# Altium project PCB_Project.PrjPcb (part 11 of 11)
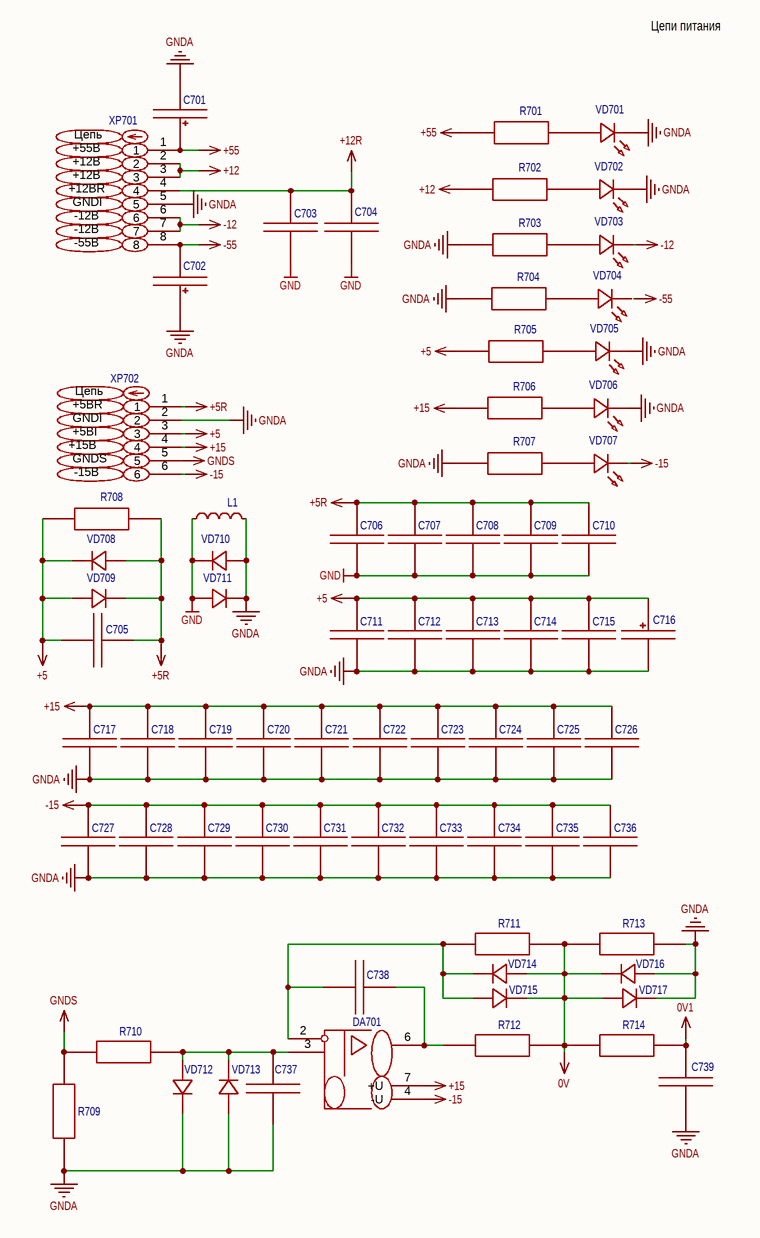
[diagram p14: УШЯИ.411618.029Э Э3 Лист 7.schdoc]

## Nets that join several sheets
0V: УШЯИ.411618.029Э Э3 Лист 2 (9 pins), УШЯИ.411618.029Э Э3 Лист 3 (R302.1 VD301.1 VD302.2), УШЯИ.411618.029Э Э3 Лист 5 (C517.2 R505.1 R519.1 R527.1), УШЯИ.411618.029Э Э3 Лист 6 (10 pins), УШЯИ.411618.029Э Э3 Лист 7 (8 pins)
0V1: УШЯИ.411618.029Э Э3 Лист 6 (DA605.2), УШЯИ.411618.029Э Э3 Лист 7 (C739.2 R714.1)
4.096V: УШЯИ.411618.029Э Э3 Лист 2 (6 pins), УШЯИ.411618.029Э Э3 Лист 6 (R625.1 R631.1)
+5: УШЯИ.411618.029Э Э3 Лист 1 (7 pins), УШЯИ.411618.029Э Э3 Лист 2 (DA204.12 DA206.12 DA210.3 R229.1), УШЯИ.411618.029Э Э3 Лист 3 (R313.1 R318.1 VD306.2), УШЯИ.411618.029Э Э3 Лист 5 (DA503.12 DA505.12 R531.1), УШЯИ.411618.029Э Э3 Лист 6 (C613.1 DA605.3 DA612.12 PR601.3), УШЯИ.411618.029Э Э3 Лист 7 (12 pins)
+5R: УШЯИ.411618.029Э Э3 Лист 1 (28 pins), УШЯИ.411618.029Э Э3 Лист 2 (DA211.9 DA211.10 DA212.14), УШЯИ.411618.029Э Э3 Лист 6 (C622.2 R646.2), УШЯИ.411618.029Э Э3 Лист 7 (10 pins)
+12: УШЯИ.411618.029Э Э3 Лист 3 (VD308.3), УШЯИ.411618.029Э Э3 Лист 7 (R702.1 XP701.2 XP701.3)
+12R: УШЯИ.411618.029Э Э3 Лист 1 (K402.1 K404.1 VD112.1 VD114.1), УШЯИ.411618.029Э Э3 Лист 7 (C703.2 C704.2 XP701.4)
+15: УШЯИ.411618.029Э Э3 Лист 2 (9 pins), УШЯИ.411618.029Э Э3 Лист 5 (DA502.7 DA503.13 DA504.7 DA505.13), УШЯИ.411618.029Э Э3 Лист 6 (11 pins), УШЯИ.411618.029Э Э3 Лист 7 (13 pins)
+55: УШЯИ.411618.029Э Э3 Лист 3 (8 pins), УШЯИ.411618.029Э Э3 Лист 5 (6 pins), УШЯИ.411618.029Э Э3 Лист 6 (5 pins), УШЯИ.411618.029Э Э3 Лист 7 (C701.1 R701.1 XP701.1)
-12: УШЯИ.411618.029Э Э3 Лист 3 (VD312.1), УШЯИ.411618.029Э Э3 Лист 7 (VD703.2 XP701.6 XP701.7)
-15: УШЯИ.411618.029Э Э3 Лист 2 (DA204.4 DA205.13 DA206.4 DA207.4), УШЯИ.411618.029Э Э3 Лист 5 (DA502.4 DA503.4 DA504.4 DA505.4), УШЯИ.411618.029Э Э3 Лист 6 (11 pins), УШЯИ.411618.029Э Э3 Лист 7 (13 pins)
-55: УШЯИ.411618.029Э Э3 Лист 3 (8 pins), УШЯИ.411618.029Э Э3 Лист 5 (6 pins), УШЯИ.411618.029Э Э3 Лист 6 (5 pins), УШЯИ.411618.029Э Э3 Лист 7 (C702.2 XP701.8)
GND: УШЯИ.411618.029Э Э3 Лист 1 (114 pins), УШЯИ.411618.029Э Э3 Лист 2 (DA205.3 DA212.7 DA212.12), УШЯИ.411618.029Э Э3 Лист 5 (R533.1 VT509.2), УШЯИ.411618.029Э Э3 Лист 6 (C622.1 DA608.1 DA609.1), УШЯИ.411618.029Э Э3 Лист 7 (10 pins)
GNDA: УШЯИ.411618.029Э Э3 Лист 2 (20 pins), УШЯИ.411618.029Э Э3 Лист 3 (15 pins), УШЯИ.411618.029Э Э3 Лист 5 (20 pins), УШЯИ.411618.029Э Э3 Лист 6 (17 pins), УШЯИ.411618.029Э Э3 Лист 7 (48 pins)
GNDS: УШЯИ.411618.029Э Э3 Лист 5 (XP502.6 XP503.1), УШЯИ.411618.029Э Э3 Лист 7 (R709.1 R710.2 XP702.5)
GRD: УШЯИ.411618.029Э Э3 Лист 4 (7 pins), УШЯИ.411618.029Э Э3 Лист 5 (6 pins)
IOC: УШЯИ.411618.029Э Э3 Лист 2 (C211.1 R213.1), УШЯИ.411618.029Э Э3 Лист 6 (K603.8 R649.2)
NV: УШЯИ.411618.029Э Э3 Лист 4 (13 pins), УШЯИ.411618.029Э Э3 Лист 5 (6 pins)
PR: УШЯИ.411618.029Э Э3 Лист 3 (5 pins), УШЯИ.411618.029Э Э3 Лист 5 (K502.14)
UOC: УШЯИ.411618.029Э Э3 Лист 2 (XP201.1), УШЯИ.411618.029Э Э3 Лист 5 (8 pins)
+U: УШЯИ.411618.029Э Э3 Лист 1 (DD114.77), УШЯИ.411618.029Э Э3 Лист 3 (R311.1)
-U: УШЯИ.411618.029Э Э3 Лист 1 (DD114.76), УШЯИ.411618.029Э Э3 Лист 3 (R319.1)
ADC: УШЯИ.411618.029Э Э3 Лист 2 (R221.2), УШЯИ.411618.029Э Э3 Лист 6 (DA612.2 DA612.15)
AZ: УШЯИ.411618.029Э Э3 Лист 1 (DD114.50), УШЯИ.411618.029Э Э3 Лист 5 (DA503.8 DA503.9)
C: УШЯИ.411618.029Э Э3 Лист 1 (DD102.3 DD114.31), УШЯИ.411618.029Э Э3 Лист 2 (DA205.7)
CA: УШЯИ.411618.029Э Э3 Лист 1 (DD107.3), УШЯИ.411618.029Э Э3 Лист 2 (DA212.1 DA212.2)
D: УШЯИ.411618.029Э Э3 Лист 1 (DD101.3 DD114.30), УШЯИ.411618.029Э Э3 Лист 2 (DA205.4)
DA: УШЯИ.411618.029Э Э3 Лист 1 (DD108.6), УШЯИ.411618.029Э Э3 Лист 2 (DA212.6)
DET: УШЯИ.411618.029Э Э3 Лист 1 (DD114.45), УШЯИ.411618.029Э Э3 Лист 5 (C518.2 DA504.6 KT503.1 R528.1), УШЯИ.411618.029Э Э3 Лист 6 (R623.1)
DET1: УШЯИ.411618.029Э Э3 Лист 1 (DD114.2), УШЯИ.411618.029Э Э3 Лист 6 (DA608.7 DA609.7 R646.1)
E1: УШЯИ.411618.029Э Э3 Лист 1 (DD103.6), УШЯИ.411618.029Э Э3 Лист 2 (DA205.5)
IMPI: УШЯИ.411618.029Э Э3 Лист 1 (DD110.3), УШЯИ.411618.029Э Э3 Лист 2 (DA206.8 DA206.9)
IMPV: УШЯИ.411618.029Э Э3 Лист 1 (DD109.6), УШЯИ.411618.029Э Э3 Лист 2 (DA205.9)
INAM: УШЯИ.411618.029Э Э3 Лист 2 (K201#2.8 R209.2), УШЯИ.411618.029Э Э3 Лист 3 (5 pins), УШЯИ.411618.029Э Э3 Лист 5 (DA503.7 DA503.10)
LM1: УШЯИ.411618.029Э Э3 Лист 1 (DD114.41), УШЯИ.411618.029Э Э3 Лист 6 (DA612.7 DA612.10 R639.1 R641.1)
LM2: УШЯИ.411618.029Э Э3 Лист 1 (DD114.40), УШЯИ.411618.029Э Э3 Лист 5 (DA503.6), УШЯИ.411618.029Э Э3 Лист 6 (XP602.3)
OUTAM: УШЯИ.411618.029Э Э3 Лист 2 (XP201.3), УШЯИ.411618.029Э Э3 Лист 3 (10 pins), УШЯИ.411618.029Э Э3 Лист 4 (16 pins), УШЯИ.411618.029Э Э3 Лист 5 (C514.1 R520.2), УШЯИ.411618.029Э Э3 Лист 6 (5 pins)
OUTI: УШЯИ.411618.029Э Э3 Лист 4 (5 pins), УШЯИ.411618.029Э Э3 Лист 6 (C631.1 K602#2.8 R606.1)
RN: УШЯИ.411618.029Э Э3 Лист 1 (DD106.3), УШЯИ.411618.029Э Э3 Лист 2 (DA212.9 DA212.10)
ST1: УШЯИ.411618.029Э Э3 Лист 1 (DD114.58), УШЯИ.411618.029Э Э3 Лист 2 (DA204.1)
ST2: УШЯИ.411618.029Э Э3 Лист 1 (DD114.57), УШЯИ.411618.029Э Э3 Лист 2 (DA204.8)
ST3: УШЯИ.411618.029Э Э3 Лист 1 (DD114.56), УШЯИ.411618.029Э Э3 Лист 2 (DA204.9)
ST4: УШЯИ.411618.029Э Э3 Лист 1 (DD114.60), УШЯИ.411618.029Э Э3 Лист 2 (DA206.1 DA206.16)
U1: УШЯИ.411618.029Э Э3 Лист 1 (DD114.49), УШЯИ.411618.029Э Э3 Лист 5 (DA505.1)
U2: УШЯИ.411618.029Э Э3 Лист 1 (DD114.48), УШЯИ.411618.029Э Э3 Лист 5 (DA505.8)
U3: УШЯИ.411618.029Э Э3 Лист 1 (DD114.47), УШЯИ.411618.029Э Э3 Лист 5 (DA505.9)
U4: УШЯИ.411618.029Э Э3 Лист 1 (DD114.52), УШЯИ.411618.029Э Э3 Лист 5 (DA503.1 DA503.16)